# EAGLE design Main (EAGLE 9.6.2)
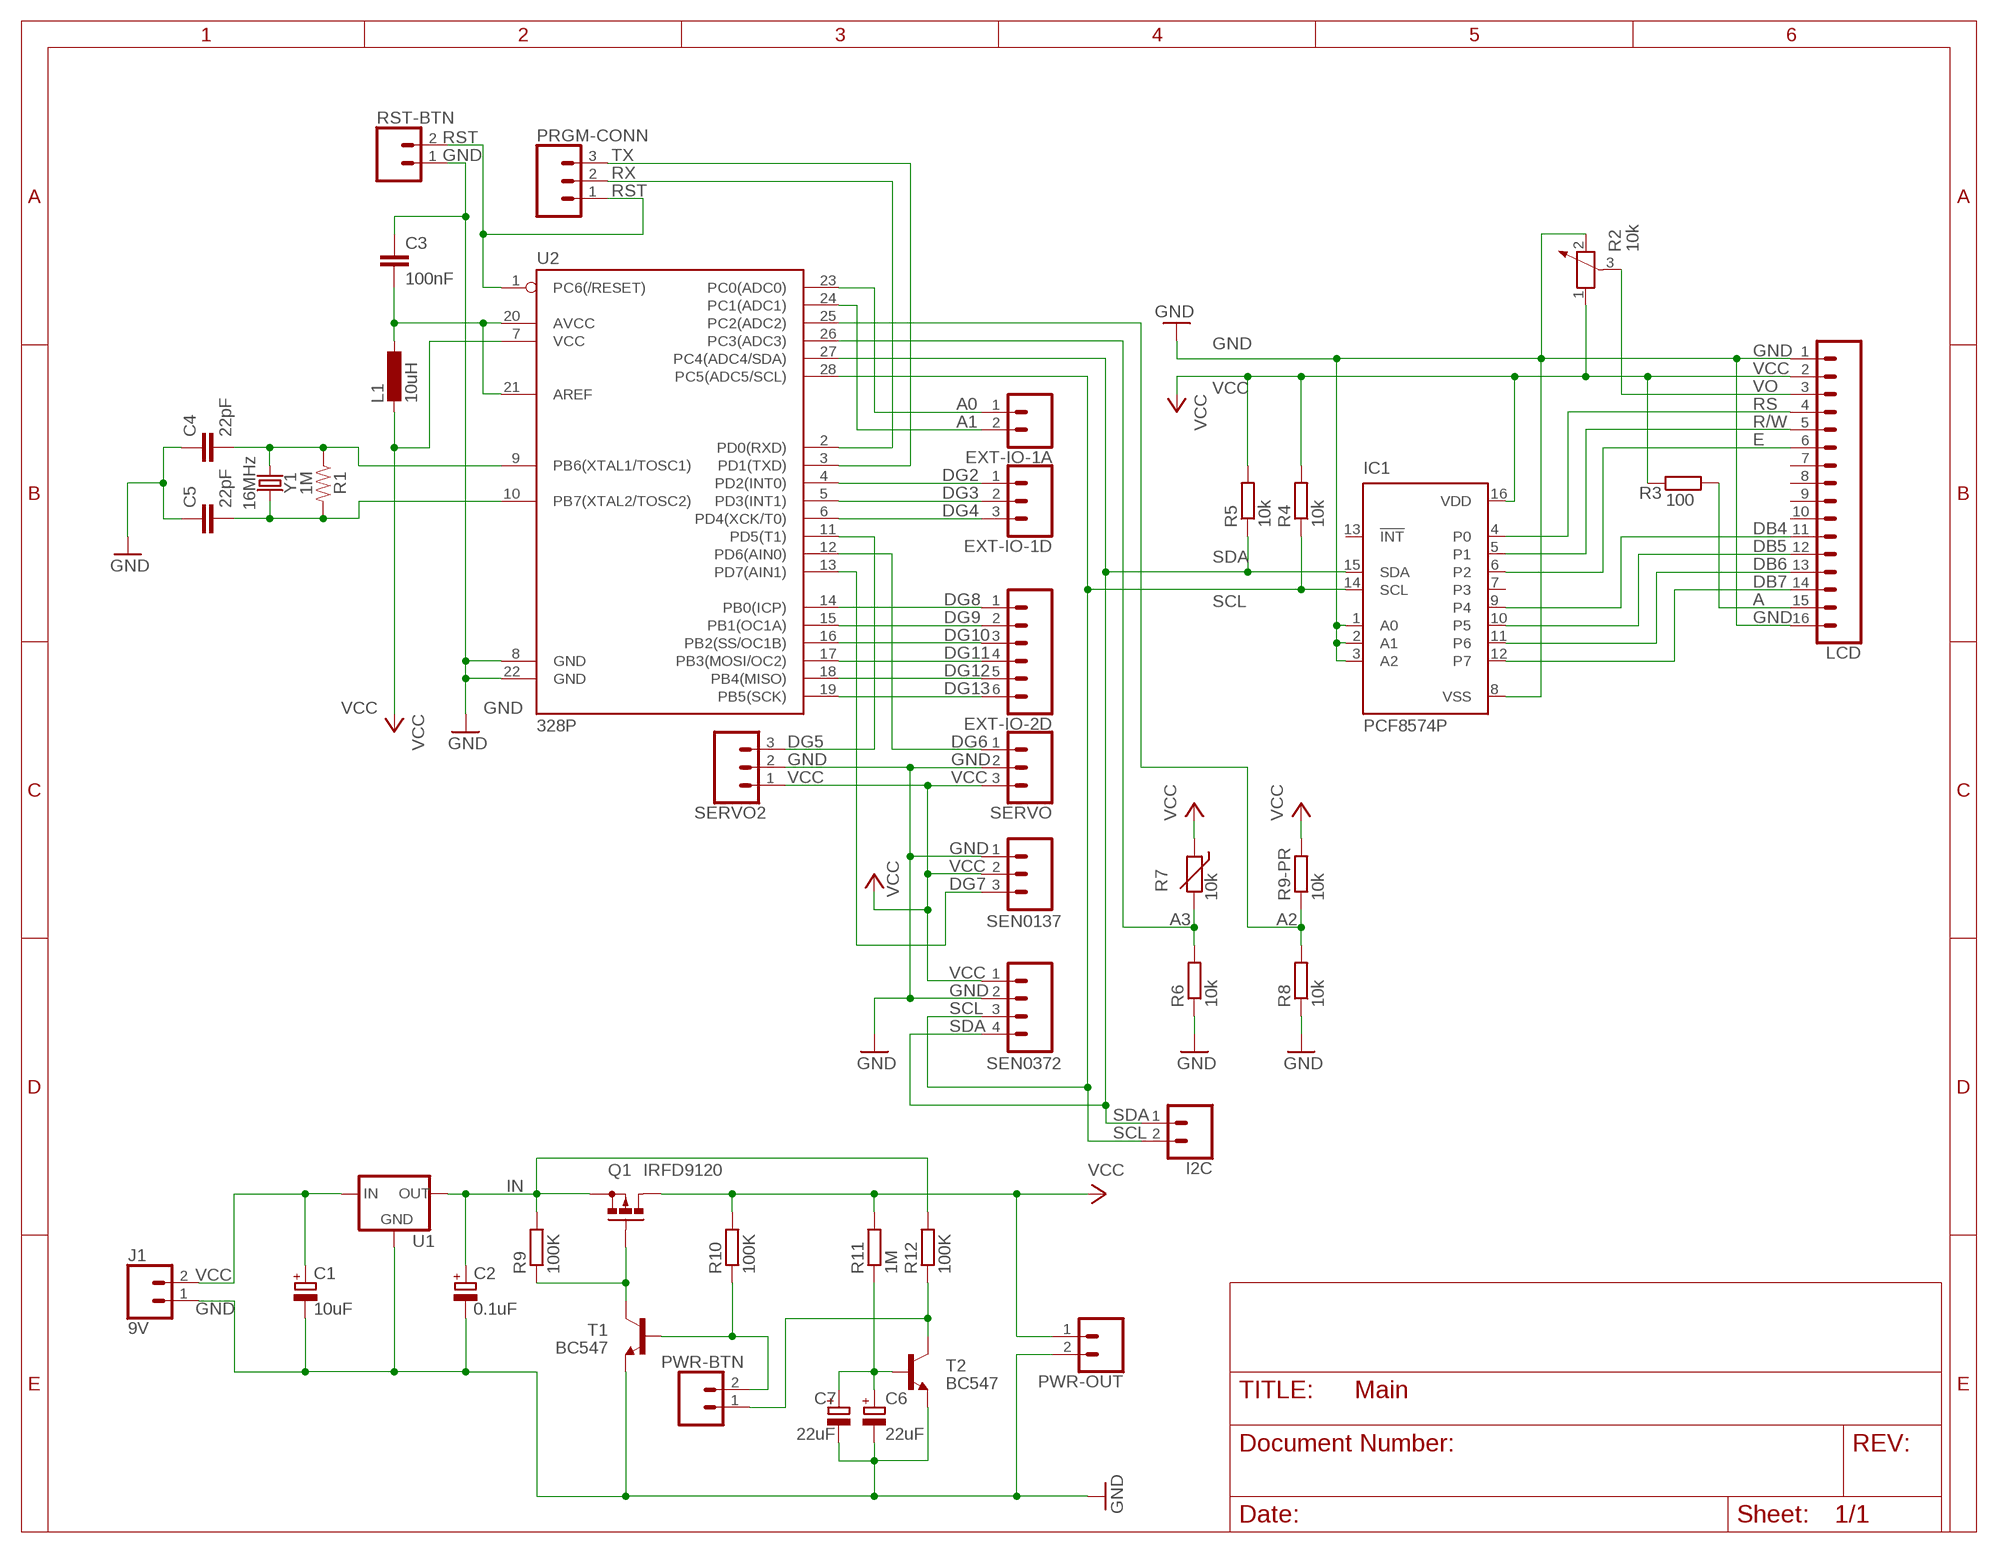
[diagram p0: schematic, sheet 1]

## Parts
C1  10uF  CPOL-EUE2.5-5  [E2,5-5]
C2  0.1uF  CPOL-EUE2-4  [E2-4]
C3  100nF  C-EU050-025X075  [C050-025X075]
C4  22pF  22PF-PTH-2.54MM-200V-5%  [CAP-PTH-2.54]
C5  22pF  22PF-PTH-2.54MM-200V-5%  [CAP-PTH-2.54]
C6  22uF  CPOL-EUE2-5  [E2-5]
C7  22uF  CPOL-EUE2-5  [E2-5]
EXT-IO-1A  CONN_02LOCK_LONGPADS  [1X02_LOCK_LONGPADS]
EXT-IO-1D  CONN_03LONGPADS  [1X03_LONGPADS]
EXT-IO-2D  CONN_06LONGPADS  [1X06_LONGPADS]
I2C  CONN_02LOCK_LONGPADS  [1X02_LOCK_LONGPADS]
IC1  PCF8574P  [DIL16]
J1  9V  CONN_02LOCK_LONGPADS  [1X02_LOCK_LONGPADS]
L1  10uH  L-EU0204/5  [0204/5]
LCD  CONN_16LONGPADS  [1X16_LONGPADS]
PRGM-CONN  CONN_03LONGPADS  [1X03_LONGPADS]
PWR-BTN  CONN_02LOCK_LONGPADS  [1X02_LOCK_LONGPADS]
PWR-OUT  CONN_02LOCK_LONGPADS  [1X02_LOCK_LONGPADS]
Q1  IRFD9120  [C370-01]
R1  1M  RESISTORAXIAL-0.3  [AXIAL-0.3]
R2  10k  POTENTIOMETER_PT-10  [PT-10]
R3  100  R-EU_0207/10  [0207/10]
R4  10k  R-EU_0207/10  [0207/10]
R5  10k  R-EU_0207/10  [0207/10]
R6  10k  R-EU_0207/10  [0207/10]
R7  10k  THERMISTOR-2,5  [RS-2,5]
R8  10k  R-EU_0207/10  [0207/10]
R9  100K  R-EU_0207/10  [0207/10]
R9-PR  10k  R-EU_0204/2V  [0204V]
R10  100K  R-EU_0207/10  [0207/10]
R11  1M  R-EU_0207/10  [0207/10]
R12  100K  R-EU_0207/10  [0207/10]
RST-BTN  CONN_02LOCK_LONGPADS  [1X02_LOCK_LONGPADS]
SEN0137  CONN_03LONGPADS  [1X03_LONGPADS]
SEN0372  CONN_04LONGPADS  [1X04_LONGPADS]
SERVO  CONN_03LONGPADS  [1X03_LONGPADS]
SERVO2  CONN_03LONGPADS  [1X03_LONGPADS]
T1  BC547  [TO92]
T2  BC547  [TO92]
U1  V_REG_78XX-TO-220  [TO-220-ALT]
U2  328P  ATMEGA328P_PDIP  [DIP28]
Y1  16MHz  CRYSTAL-16MHZPTH-HC49US  [HC49US]

## Nets
A: LCD.15 R3.2
A0: EXT-IO-1A.1 U2.23(PC0(ADC0))
A1: EXT-IO-1A.2 U2.24(PC1(ADC1))
A2: R8.2 R9-PR.1 U2.25(PC2(ADC2))
A3: R6.2 R7.2 U2.26(PC3(ADC3))
DB4: IC1.9(P4) LCD.11
DB5: IC1.10(P5) LCD.12
DB6: IC1.11(P6) LCD.13
DB7: IC1.12(P7) LCD.14
DG2: EXT-IO-1D.1 U2.4(PD2(INT0))
DG3: EXT-IO-1D.2 U2.5(PD3(INT1))
DG4: EXT-IO-1D.3 U2.6(PD4(XCK/T0))
DG5: SERVO2.3 U2.11(PD5(T1))
DG6: SERVO.1 U2.12(PD6(AIN0))
DG7: SEN0137.3 U2.13(PD7(AIN1))
DG8: EXT-IO-2D.1 U2.14(PB0(ICP))
DG9: EXT-IO-2D.2 U2.15(PB1(OC1A))
DG10: EXT-IO-2D.3 U2.16(PB2(SS/OC1B))
DG11: EXT-IO-2D.4 U2.17(PB3(MOSI/OC2))
DG12: EXT-IO-2D.5 U2.18(PB4(MISO))
DG13: EXT-IO-2D.6 U2.19(PB5(SCK))
E: IC1.6(P2) LCD.6
GND: C1.- C2.- C3.1 C4.1 C5.1 C6.- C7.- IC1.1(A0) IC1.2(A1) IC1.3(A2) IC1.8(VSS) J1.1 LCD.1 LCD.16 PWR-OUT.2 R2.2 R6.1 R8.1 RST-BTN.1 SEN0137.1 SEN0372.2 SERVO2.2 SERVO.2 T1.1(E) T2.1(E) U1.GND U2.8(GND) U2.22(GND)
IN: C2.+ Q1.S R9.2 R12.2 U1.OUT
N$1: Q1.G R9.1 T1.3(C)
N$2: C3.2 L1.1 U2.20(AVCC) U2.21(AREF)
N$3: C4.2 R1.P$1 U2.9(PB6(XTAL1/TOSC1)) Y1.1
N$4: C5.2 R1.P$2 U2.10(PB7(XTAL2/TOSC2)) Y1.2
N$9: PWR-BTN.2 R10.1 T1.2(B)
N$10: PWR-BTN.1 R12.1 T2.3(C)
N$11: C6.+ C7.+ R11.1 T2.2(B)
R/W: IC1.5(P1) LCD.5
RS: IC1.4(P0) LCD.4
RST: PRGM-CONN.1 RST-BTN.2 U2.1(PC6(/RESET))
RX: PRGM-CONN.2 U2.2(PD0(RXD))
SCL: I2C.2 IC1.14(SCL) R4.1 SEN0372.3 U2.28(PC5(ADC5/SCL))
SDA: I2C.1 IC1.15(SDA) R5.1 SEN0372.4 U2.27(PC4(ADC4/SDA))
TX: PRGM-CONN.3 U2.3(PD1(TXD))
VCC: C1.+ IC1.16(VDD) J1.2 L1.2 LCD.2 PWR-OUT.1 Q1.D Q1.D1(D) R2.1 R3.1 R4.2 R5.2 R7.1 R9-PR.2 R10.2 R11.2 SEN0137.2 SEN0372.1 SERVO2.1 SERVO.3 U1.IN U2.7(VCC)
VO: LCD.3 R2.3
Unconnected: IC1.7(P3) IC1.13(!INT) LCD.7 LCD.8 LCD.9 LCD.10

## Library data of the parts
C1 C2 C6 C7 = rcl:CPOL-EU: POLARIZED CAPACITOR, European symbol; SPICEPREFIX: C
C3 = rcl:C-EU: CAPACITOR, European symbol; SPICEPREFIX: C
C4 C5 = SparkFun-Capacitors:22PF: 22pF ceramic capacitors A capacitor is a passive two-terminal electrical component used to store electrical energy temporarily in an electric field.; PROD_ID: CAP-09128
EXT-IO-1A I2C J1 PWR-BTN PWR-OUT RST-BTN = SparkFun-Connectors:CONN_02: Multi connection point. Often used as Generic Header-pin footprint for 0.1 inch spaced/style header connections On any of the 0.1 inch spaced packages, you can populate with these: Break Away Headers - Straight <https://www.sparkfun.com/products/116> (PRT-00116) Break Away Male Headers - Right Angle <https://www.sparkfun.com/products/553> (PRT-00553) Female Headers <https://www.sparkfun.com/products/115> (PRT-00115) Break Away Headers - Machine Pin <https://www.sparkfun.com/products/117> (PRT-00117) Break Away Female Headers - Swiss Machine Pin <https://www.sparkfun.com/products/743> (PRT-00743) For SCREWTERMINALS and SPRING TERMINALS visit here: Screw Terimnals on SparkFun.com <https://www.sparkfun.com/search/results?term=Screw+Terminals> (5mm/3.5mm/2.54mm spacing) This device is also useful as a general connection point to wire up your design to another part of your project. Our various solder wires solder well into these plated through hole pads. Hook-Up Wire - Assortment (Stranded, 22 AWG) <https://www.sparkfun.com/products/11375> (PRT-11375) Hook-Up Wire - Assortment (Solid Core, 22 AWG) <https://www.sparkfun.com/products/11367> (PRT-11367) View the entire wire category on our website here <https://www.sparkfun.com/categories/141> Special notes: Molex polarized connector foot print use with: PRT-08233 with associated crimp pins and housings. 2.54_SCREWTERM for use with PRT-10571. 3.5mm Screw Terminal footprints for PRT-08084 5mm Screw Terminal footprints for use with PRT-08432
EXT-IO-1D PRGM-CONN SEN0137 SERVO SERVO2 = SparkFun-Connectors:CONN_03: Multi connection point. Often used as Generic Header-pin footprint for 0.1 inch spaced/style header connections On any of the 0.1 inch spaced packages, you can populate with these: Break Away Headers - Straight <https://www.sparkfun.com/products/116> (PRT-00116) Break Away Male Headers - Right Angle <https://www.sparkfun.com/products/553> (PRT-00553) Female Headers <https://www.sparkfun.com/products/115> (PRT-00115) Break Away Headers - Machine Pin <https://www.sparkfun.com/products/117> (PRT-00117) Break Away Female Headers - Swiss Machine Pin <https://www.sparkfun.com/products/743> (PRT-00743) Stackable Header - 3 Pin (Female, 0.1") <https://www.sparkfun.com/products/13875> (PRT-13875) For SCREWTERMINALS and SPRING TERMINALS visit here: Screw Terimnals on SparkFun.com <https://www.sparkfun.com/search/results?term=Screw+Terminals> (5mm/3.5mm/2.54mm spacing) This device is also useful as a general connection point to wire up your design to another part of your project. Our various solder wires solder well into these plated through hole pads. Hook-Up Wire - Assortment (Stranded, 22 AWG) <https://www.sparkfun.com/products/11375> (PRT-11375) Hook-Up Wire - Assortment (Solid Core, 22 AWG) <https://www.sparkfun.com/products/11367> (PRT-11367) View the entire wire category on our website here <https://www.sparkfun.com/categories/141> Special notes: Molex polarized connector foot print use with SKU : PRT-08232 with associated crimp pins and housings.
EXT-IO-2D = SparkFun-Connectors:CONN_06: Multi connection point. Often used as Generic Header-pin footprint for 0.1 inch spaced/style header connections On any of the 0.1 inch spaced packages, you can populate with these: Break Away Headers - Straight <https://www.sparkfun.com/products/116> (PRT-00116) Break Away Male Headers - Right Angle <https://www.sparkfun.com/products/553> (PRT-00553) Female Headers <https://www.sparkfun.com/products/115> (PRT-00115) Break Away Headers - Machine Pin <https://www.sparkfun.com/products/117> (PRT-00117) Break Away Female Headers - Swiss Machine Pin <https://www.sparkfun.com/products/743> (PRT-00743) Arduino Stackable Header - 6 Pin <https://www.sparkfun.com/products/9280> (PRT-09280) For SCREWTERMINALS and SPRING TERMINALS visit here: Screw Terimnals on SparkFun.com <https://www.sparkfun.com/search/results?term=Screw+Terminals> (5mm/3.5mm/2.54mm spacing) This device is also useful as a general connection point to wire up your design to another part of your project. Our various solder wires solder well into these plated through hole pads. Hook-Up Wire - Assortment (Stranded, 22 AWG) <https://www.sparkfun.com/products/11375> (PRT-11375) Hook-Up Wire - Assortment (Solid Core, 22 AWG) <https://www.sparkfun.com/products/11367> (PRT-11367) View the entire wire category on our website here <https://www.sparkfun.com/categories/141>
IC1 = micro-philips:PCF8574: I2C-Bus Remote 8-bit I/O expander http://www.semiconductors.philips.com/acrobat_download/datasheets/PCF8574_4.pdf; MPN: PCF8574PN; OC_FARNELL: 204020; OC_NEWARK: 11N8515
L1 = rcl:L-EU: INDUCTOR, European symbol; SPICEPREFIX: L
LCD = SparkFun-Connectors:CONN_16: Multi connection point. Often used as Generic Header-pin footprint for 0.1 inch spaced/style header connections On any of the 0.1 inch spaced packages, you can populate with these: Break Away Headers - Straight <https://www.sparkfun.com/products/116> (PRT-00116) Break Away Male Headers - Right Angle <https://www.sparkfun.com/products/553> (PRT-00553) Female Headers <https://www.sparkfun.com/products/115> (PRT-00115) Break Away Headers - Machine Pin <https://www.sparkfun.com/products/117> (PRT-00117) Break Away Female Headers - Swiss Machine Pin <https://www.sparkfun.com/products/743> (PRT-00743) For SCREWTERMINALS and SPRING TERMINALS visit here: Screw Terimnals on SparkFun.com <https://www.sparkfun.com/search/results?term=Screw+Terminals> (5mm/3.5mm/2.54mm spacing) This device is also useful as a general connection point to wire up your design to another part of your project. Our various solder wires solder well into these plated through hole pads. Hook-Up Wire - Assortment (Stranded, 22 AWG) <https://www.sparkfun.com/products/11375> (PRT-11375) Hook-Up Wire - Assortment (Solid Core, 22 AWG) <https://www.sparkfun.com/products/11367> (PRT-11367) View the entire wire category on our website here <https://www.sparkfun.com/categories/141> Special notes: Molex polarized connector foot print use with SKU : PRT-08231 with associated crimp pins and housings. 1MM SMD Version SKU: PRT-10208 NOTES ON THE VARIANTS LOCK and LOCK_LONGPADS... This footprint was designed to help hold the alignment of a through-hole component (i.e. 6-pin header) while soldering it into place. You may notice that each hole has been shifted either up or down by 0.005 of an inch from it's more standard position (which is a perfectly straight line). This slight alteration caused the pins (the squares in the middle) to touch the edges of the holes. Because they are alternating, it causes a "brace" to hold the component in place. 0.005 has proven to be the perfect amount of "off-center" position when using our standard breakaway headers. Although looks a little odd when you look at the bare footprint, once you have a header in there, the alteration is very hard to notice. Also,if you push a header all the way into place, it is covered up entirely on the bottom side.
Q1 = transistor-small-signal:IRFD9120: P-CHANNEL MOS FET
R1 = SparkFun-Resistors:RESISTOR: Generic Resistor Package
R2 = rcl:POTENTIOMETER_: Potentiometer; SPICEMODEL: POT; SPICEPREFIX: X
R3-R6 R8 R9 R9-PR R10-R12 = rcl:R-EU_: RESISTOR, European symbol; SPICEPREFIX: R
R7 = varistor:THERMISTOR: THERMISTOR
SEN0372 = SparkFun-Connectors:CONN_04: Multi connection point. Often used as Generic Header-pin footprint for 0.1 inch spaced/style header connections On any of the 0.1 inch spaced packages, you can populate with these: Break Away Headers - Straight <https://www.sparkfun.com/products/116> (PRT-00116) Break Away Male Headers - Right Angle <https://www.sparkfun.com/products/553> (PRT-00553) Female Headers <https://www.sparkfun.com/products/115> (PRT-00115) Break Away Headers - Machine Pin <https://www.sparkfun.com/products/117> (PRT-00117) Break Away Female Headers - Swiss Machine Pin <https://www.sparkfun.com/products/743> (PRT-00743) For SCREWTERMINALS and SPRING TERMINALS visit here: Screw Terimnals on SparkFun.com <https://www.sparkfun.com/search/results?term=Screw+Terminals> (5mm/3.5mm/2.54mm spacing) This device is also useful as a general connection point to wire up your design to another part of your project. Our various solder wires solder well into these plated through hole pads. Hook-Up Wire - Assortment (Stranded, 22 AWG) <https://www.sparkfun.com/products/11375> (PRT-11375) Hook-Up Wire - Assortment (Solid Core, 22 AWG) <https://www.sparkfun.com/products/11367> (PRT-11367) View the entire wire category on our website here <https://www.sparkfun.com/categories/141> Special notes: Molex polarized connector foot print use with SKU : PRT-08231 with associated crimp pins and housings. 1MM SMD Version SKU: PRT-10208; PROD_ID: CONN-09696
T1 T2 = transistor:BC547: NPN TRANSISTOR
U1 = SparkFun-IC-Power:V_REG_78XX: Voltage Regulator Standard 78xx regulator. IGO (Input Ground Output). Spark Fun Electronics SKU : COM-00107; PROD_ID: VREG-08450; SF_ID: COM-00107
U2 = SparkFun-IC-Microcontroller:ATMEGA328P_PDIP: Atmel 328P Through hole ATMEGA328P uC used in the Arduino 32kb flash, 1k EEPROM, 2k SRAM Datasheet <http://www.sparkfun.com/datasheets/Components/SMD/ATMega328.pdf> SparkFun Products Storefront component: AVR 28 Pin 20MHz 32K 6A/D - ATMega328P <https://www.sparkfun.com/products/9061> (COM-09061) SparkFun Simon Says - Through-Hole Soldering Kit <https://www.sparkfun.com/products/10547> (KIT-10547) SparkFun Learn to Solder - Simon Says <https://www.sparkfun.com/products/13708> (KIT-13708) SparkFun BigTime Watch Kit <https://www.sparkfun.com/products/11734> (KIT-11734) SparkFun ClockIt <https://www.sparkfun.com/products/10930> (KIT-10930) SparkFun Serial Enabled LCD Kit <https://www.sparkfun.com/products/10097> (LCD-10097) SparkFun Simon Tilts - Through Hole Soldering Kit <https://www.sparkfun.com/products/12634> (KIT-12634) SparkFun Frequency Counter Kit <https://www.sparkfun.com/products/10140> (KIT-10140) FabFM Radio Kit <https://www.sparkfun.com/products/11043> (KIT-11043) SparkFun Binary Blaster Kit <https://www.sparkfun.com/products/12037> (KIT-12037) SparkFun Metro-Gnome <https://www.sparkfun.com/products/9236> (KIT-09236) ATmega328 with Arduino Optiboot (Uno) <https://www.sparkfun.com/products/10524> (DEV-10524); PROD_ID: IC-09136
Y1 = SparkFun-Clocks:CRYSTAL-16MHZ: 16MHz Crystal Digikey Example <http://www.digikey.com/product-search/en?keywords=535-9122-1-ND> Frequency: 16MHz Frequency Stability: ±50ppm Frequency Tolerance: ±20ppm Load Capacitance: 18pF SparkFun Products: Pro Micro -5V/16MHz <https://www.sparkfun.com/products/12640> SparkFun Serial Enabled LCD Kit <https://www.sparkfun.com/products/10097>; PROD_ID: XTAL-08181; SF_ID: COM-00536

## Board
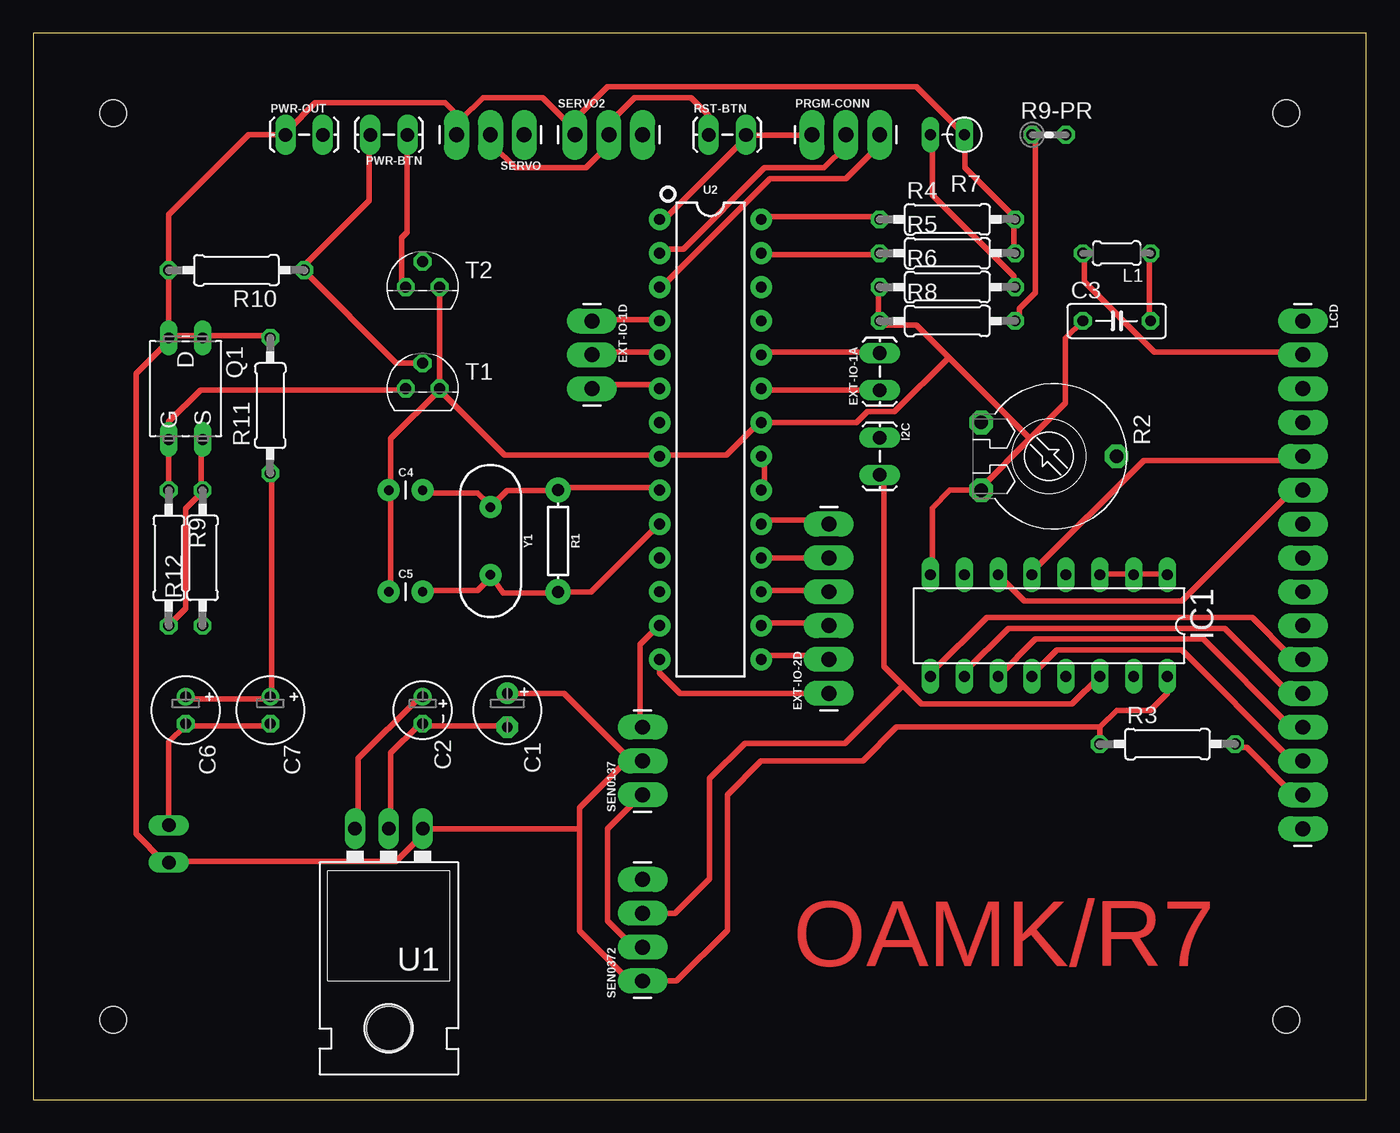
[diagram p1: board, top side]
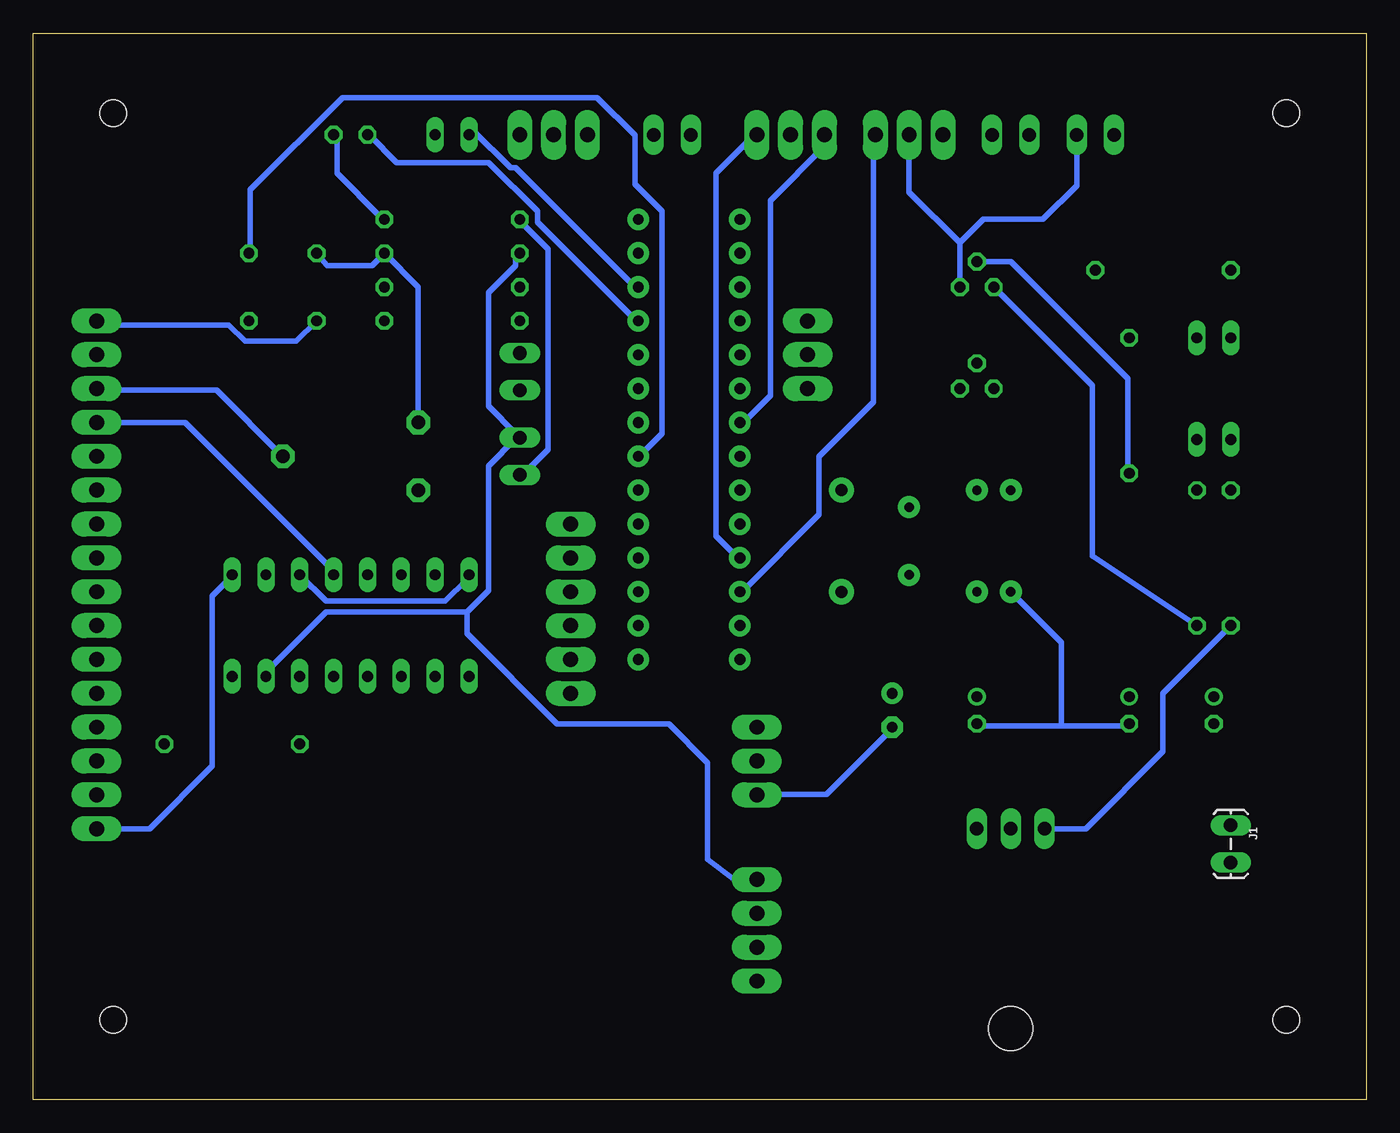
[diagram p2: board, bottom side, seen from below]

Size 100 x 80 mm. Coordinates in mm from the lower left corner, seen from the top.
Outline: 0,0 100,0 100,80 0,80 0,0
Copper layers (1*16): Top 0.018mm / dielectric 1mm / Bottom 0.018mm
Design rules "RULES *": minimum track width 16mil, minimum drill 0.3mm, track to track 16mil, track to pad 16mil, pad to pad 16mil, via to via 16mil, smd to smd 16mil, copper to edge 40mil, drill to drill 16mil, minimum pad ring 10mil, minimum via ring 8mil, stop-mask expansion 4mil, vias tented up to drill 0mil, thermal gap 10mil
Holes 2 mm at 6,6 94,6 6,74 94,74

### Footprints (pad centres in the part's own frame; a part is rotated, then mirrored left to right if it is on the bottom)
E2,5-5 = drill 0.813 pad 1.6: + -1.27,0 | drill 0.813 pad 1.6 octagon: - 1.27,0
E2-4 = drill 0.813 pad 1.27: + -1.016,0 | drill 0.813 pad 1.27 octagon: - 1.016,0
C050-025X075 = drill 0.813 octagon: 1 -2.54,0; 2 2.54,0
CAP-PTH-2.54 = drill 0.7 pad 1.651: 1 -1.27,0; 2 1.27,0
E2-5 = drill 0.813 pad 1.27: + -1.016,0 | drill 0.813 pad 1.27 octagon: - 1.016,0
1X02_LOCK_LONGPADS = drill 1.016 long: 1 -0.127,0; 2 2.667,0
1X03_LONGPADS = drill 1.118 pad 1.88 long: 1 0,0; 2 2.54,0; 3 5.08,0
1X06_LONGPADS = drill 1.118 pad 1.88 long: 1 0,0; 2 2.54,0; 3 5.08,0; 4 7.62,0; 5 10.16,0; 6 12.7,0
DIL16 = drill 0.813 long: 1 -8.89,-3.81; 2 -6.35,-3.81; 3 -3.81,-3.81; 4 -1.27,-3.81; 5 1.27,-3.81; 6 3.81,-3.81; 7 6.35,-3.81; 8 8.89,-3.81; 9 8.89,3.81; 10 6.35,3.81; 11 3.81,3.81; 12 1.27,3.81; 13 -1.27,3.81; 14 -3.81,3.81; 15 -6.35,3.81; 16 -8.89,3.81
0204/5 = drill 0.813 octagon: 1 -2.54,0; 2 2.54,0
1X16_LONGPADS = drill 1.118 pad 1.88 long: 1 0,0; 2 2.54,0; 3 5.08,0; 4 7.62,0; 5 10.16,0; 6 12.7,0; 7 15.24,0; 8 17.78,0; 9 20.32,0; 10 22.86,0; 11 25.4,0; 12 27.94,0; 13 30.48,0; 14 33.02,0; 15 35.56,0; 16 38.1,0
C370-01 = drill 0.813 long: D -3.81,1.27; D1 -3.81,-1.27; G 3.81,-1.27; S 3.81,1.27
AXIAL-0.3 = drill 0.9 pad 1.88: P$1 -3.81,0; P$2 3.81,0
PT-10 = drill 1.016 pad 1.778 octagon: 1 -2.54,-5.08; 2 2.54,-5.08; 3 0,5.08
0207/10 = drill 0.813 octagon: 1 -5.08,0; 2 5.08,0
RS-2,5 = drill 0.813 long: 1 -1.27,0; 2 1.27,0
0204V = drill 0.813 octagon: 1 -1.27,0; 2 1.27,0
1X04_LONGPADS = drill 1.118 pad 1.88 long: 1 0,0; 2 2.54,0; 3 5.08,0; 4 7.62,0
TO92 = drill 0.813 octagon: 1 1.27,0; 2 0,1.905; 3 -1.27,0
TO-220-ALT = drill 1.016 long: GND 0,-3.81; IN -2.54,-3.81; OUT 2.54,-3.81 | hole 3.302: 0,11.176
DIP28 = drill 0.813 pad 1.626: 1 -16.51,-3.81; 2 -13.97,-3.81; 3 -11.43,-3.81; 4 -8.89,-3.81; 5 -6.35,-3.81; 6 -3.81,-3.81; 7 -1.27,-3.81; 8 1.27,-3.81; 9 3.81,-3.81; 10 6.35,-3.81; 11 8.89,-3.81; 12 11.43,-3.81; 13 13.97,-3.81; 14 16.51,-3.81; 15 16.51,3.81; 16 13.97,3.81; 17 11.43,3.81; 18 8.89,3.81; 19 6.35,3.81; 20 3.81,3.81; 21 1.27,3.81; 22 -1.27,3.81; 23 -3.81,3.81; 24 -6.35,3.81; 25 -8.89,3.81; 26 -11.43,3.81; 27 -13.97,3.81; 28 -16.51,3.81
HC49US = drill 0.7 pad 1.651: 1 -2.54,0; 2 2.54,0

### Placement (x,y rotation side)
C1  35.56,29.21 270 top
C2  29.21,29.21 270 top
C3  81.28,58.42 0 top
C4  27.94,45.72 0 top
C5  27.94,38.1 0 top
C6  11.43,29.21 270 top
C7  17.78,29.21 270 top
EXT-IO-1A  63.5,53.34 90 top
EXT-IO-1D  41.91,58.42 270 top
EXT-IO-2D  59.69,30.48 90 top
I2C  63.5,49.53 270 top
IC1  76.2,35.56 180 top
J1  10.16,20.45 270 bottom
L1  81.28,63.5 180 top
LCD  95.25,58.42 270 top
PRGM-CONN  58.42,72.39 0 top
PWR-BTN  27.94,72.39 180 top
PWR-OUT  19.05,72.39 0 top
Q1  11.43,53.34 270 top
R1  39.37,41.91 270 top
R2  76.2,48.26 270 top
R3  85.09,26.67 0 top
R4  68.58,66.04 0 top
R5  68.58,63.5 0 top
R6  68.58,60.96 0 top
R7  68.58,72.39 180 top
R8  68.58,58.42 0 top
R9  10.16,40.64 270 top
R9-PR  76.2,72.39 0 top
R10  15.24,62.23 180 top
R11  17.78,52.07 90 top
R12  12.7,40.64 90 top
RST-BTN  50.8,72.39 0 top
SEN0137  45.72,22.86 90 top
SEN0372  45.72,8.89 90 top
SERVO  36.83,72.39 180 top
SERVO2  40.64,72.39 0 top
T1  29.21,53.34 0 top
T2  29.21,60.96 0 top
U1  26.67,16.51 180 top
U2  50.8,49.53 270 top
Y1  34.29,41.91 270 top

### Tracks (layer width: path | path; a pad name or v marks a point on that pad's centre or on a via)
A
  Top 0.406: R3.2 90.22,26.42 91.03,26.42 94.28,23.16 95.1,23.16 LCD.15
A0
  Top 0.406: EXT-IO-1A.1 63.4,53.24 54.86,53.24 U2.23
A1
  Top 0.406: EXT-IO-1A.2 63.4,56.08 54.86,56.08 U2.24
A2
  Top 0.406: R8.2 73.97,58.52 73.97,59.33 75.18,60.55 75.18,72.34 R9-PR.1
  Bottom 0.406: U2.25 54.86,58.52 62.18,65.84 62.18,66.65 65.84,70.31 72.75,70.31 74.78,72.34 R9-PR.1
A3
  Top 0.406: R6.2 73.56,60.96 73.56,61.77 67.46,67.87 67.46,72.34 R7.2
  Bottom 0.406: U2.26 54.86,60.96 63.8,69.9 64.21,69.9 67.06,72.75 R7.2
DB4
  Top 0.406: IC1.9 67.46,32.11 71.53,36.17 91.44,36.17 94.28,33.33 95.1,33.33 LCD.11
DB5
  Top 0.406: LCD.12 94.28,30.48 89.41,35.36 73.15,35.36 69.9,32.11 IC1.10
DB6
  Top 0.406: IC1.11 75.18,34.54 87.78,34.54 94.28,28.04 95.1,28.04 LCD.13
DB7
  Top 0.406: IC1.12 75.18,32.11 76.81,33.73 86.16,33.73 94.28,25.6 95.1,25.6 LCD.14
DG2
  Top 0.406: U2.4 46.74,58.52 42.27,58.52 EXT-IO-1D.1
DG3
  Top 0.406: U2.5 46.74,56.08 42.27,56.08 EXT-IO-1D.2
DG4
  Top 0.406: U2.6 46.74,53.65 42.27,53.65 EXT-IO-1D.3
DG5
  Bottom 0.406: U2.11 47.14,40.64 48.77,42.27 48.77,69.49 45.92,72.34 SERVO2.3
DG6
  Bottom 0.406: U2.12 46.74,38.2 41.05,43.89 41.05,48.26 36.98,52.32 36.98,72.34 SERVO.1
DG7
  Top 0.406: U2.13 46.74,35.36 45.52,34.14 45.52,28.04 SEN0137.3
DG8
  Top 0.406: U2.14 46.99,32 48.51,30.48 EXT-IO-2D.1
DG9
  Top 0.406: U2.15 54.86,33.33 59.33,33.33 EXT-IO-2D.2
DG10
  Top 0.406: U2.16 54.86,35.76 59.33,35.76 EXT-IO-2D.3
DG11
  Top 0.406: U2.17 54.86,38.2 59.33,38.2 EXT-IO-2D.4
DG12
  Top 0.406: EXT-IO-2D.5 U2.18
DG13
  Top 0.406: U2.19 54.86,43.48 59.33,43.48 EXT-IO-2D.6
E
  Top 0.406: IC1.6 74.37,37.39 86.16,37.39 94.28,45.52 95.1,45.52 LCD.6
GND
  Top 0.406: IC1.3 80.06,39.42 82.5,39.42 IC1.2 82.91,39.42 84.94,39.42 IC1.1 | R6.1 63.4,60.96 63.4,58.52 R8.1 63.8,58.12 66.24,58.12 68.68,55.68 | IC1.8 67.46,39.42 67.46,44.4 68.78,45.72 R2.2 71.12,45.92 74.78,49.58 | 74.78,49.58 77.44,52.24 77.44,57.12 C3.1 | 74.78,49.58 68.68,55.68 | 68.68,55.68 64.62,51.61 62.59,51.61 61.77,50.8 U2.22 54.46,50.8 52.02,48.36 47.14,48.36 U2.8 46.74,48.36 35.36,48.36 30.48,53.24 | C7.- 17.48,28.04 11.79,28.04 C6.- 11.38,28.04 10.16,26.82 J1.1 | SEN0372.2 45.52,11.79 44.7,11.79 43.08,13.41 43.08,20.32 45.52,22.76 SEN0137.1 | C1.- 35.36,28.04 29.26,28.04 C2.- 28.85,28.04 26.82,26.01 26.82,20.32 U1.GND | RST-BTN.1 50.67,73.84 49.33,75.18 45.11,75.18 43.48,73.56 43.48,72.75 SERVO2.2 43.08,72.34 43.08,71.53 41.45,69.9 36.17,69.9 34.54,71.53 34.54,72.34 SERVO.2 | C5.1 26.82,38.2 26.82,45.52 C4.1 26.82,45.92 26.82,49.58 30.48,53.24 | T2.1 T1.1 30.48,53.24
  Bottom 0.406: LCD.16 91.28,20.32 86.56,25.04 86.56,37.8 85.34,39.01 IC1.1 | LCD.1 95.1,58.12 85.34,58.12 84.12,56.9 80.26,56.9 C3.1 | IC1.3 78.03,37.39 69.09,37.39 67.46,39.01 IC1.8 | SEN0137.1 45.69,22.89 40.5,22.89 35.76,27.64 C1.- | 22.86,28.04 28.85,28.04 C2.- | T2.1 30.48,64.29 | C5.1 22.86,34.29 22.86,28.04 | 30.48,64.29 34.29,68.1 SERVO.2 | 30.48,64.29 28.73,66.04 24.26,66.04 21.72,68.58 PWR-OUT.2 | C7.- 17.93,28.04 22.86,28.04
IN
  Top 0.406: C2.+ 28.85,30.07 24.38,25.6 24.38,20.32 U1.OUT | R9.2 11.43,36.83 11.43,44.35 12.6,45.52 R12.2 12.6,45.92 12.6,49.17 Q1.S
  Bottom 0.406: R9.2 15.24,30.48 15.24,26.11 21.03,20.32 U1.OUT
N$1
  Top 0.406: R9.1 Q1.G 10.16,50.85 12.55,53.24 27.64,53.24 T1.3
N$2
  Top 0.406: C3.2 83.72,58.52 83.72,63.45 L1.1 | U2.20 54.86,45.92 54.86,47.95 U2.21
  Bottom 0.406: L1.1 83.72,63.86 83.72,68.28 76.81,75.18 57.71,75.18 54.86,72.34 54.86,68.68 52.83,66.65 52.83,49.99 54.46,48.36 U2.21
N$3
  Top 0.406: U2.9 46.74,45.92 39.42,45.92 R1.P$1 39.34,45.7 35.54,45.7 Y1.1 34.14,44.7 33.33,45.52 29.26,45.52 C4.2
N$4
  Top 0.406: C5.2 29.26,38.2 33.33,38.2 34.14,39.01 Y1.2 35.26,38.01 39.28,38.01 R1.P$2 41.86,38.1 46.91,43.15 U2.10
N$9
  Top 0.406: T1.2 28.85,55.27 27.23,55.27 20.32,62.18 R10.1 20.32,62.59 25.2,67.46 25.2,72.34 PWR-BTN.2
N$10
  Top 0.406: PWR-BTN.1 28.04,72.34 28.04,65.08 27.64,64.67 27.64,60.96 T2.3
  Bottom 0.406: R12.1 20.55,40.79 20.55,53.56 T2.3
N$11
  Top 0.406: C6.+ 11.79,30.07 17.48,30.07 C7.+ 17.88,30.48 17.88,46.74 R11.1
  Bottom 0.406: T2.2 26.64,62.87 17.88,54.1 17.88,47.14 R11.1
R/W
  Top 0.406: IC1.5 74.93,39.57 83.31,47.95 95.1,47.95 LCD.5
RS
  Bottom 0.406: IC1.4 77.47,39.67 88.59,50.8 LCD.4
RST
  Top 0.406: 53.65,72.34 58.12,72.34 PRGM-CONN.1 | 53.65,72.34 47.35,66.04 U2.1 | 53.65,72.34 RST-BTN.2
RX
  Top 0.406: PRGM-CONN.2 60.96,71.53 59.33,69.9 54.86,69.9 48.77,63.8 47.14,63.8 U2.2
SCL
  Top 0.406: R4.1 63.4,66.24 54.86,66.24 U2.28 | 65.25,31.06 63.8,32.51 63.8,46.74 I2C.2 | 65.25,31.06 66.65,29.67 77.93,29.67 IC1.14 | 65.25,31.06 60.91,26.72 53.39,26.72 50.75,24.08 50.75,16.56 48.16,13.97 SEN0372.3
  Bottom 0.406: R4.1 63.4,65.84 61.37,63.8 61.37,48.77 63.4,46.74 I2C.2
SDA
  Top 0.406: R5.1 63.4,63.4 54.86,63.4 U2.27
  Bottom 0.406: 67.46,36.58 78.03,36.58 82.5,32.11 IC1.15 | 67.46,36.58 65.84,38.2 65.84,47.55 63.8,49.58 I2C.1 63.8,49.99 65.84,52.02 65.84,60.55 63.8,62.59 63.8,63.4 R5.1 | 67.46,36.58 67.46,34.95 60.71,28.19 52.32,28.19 49.4,25.27 49.4,18 47.41,16.51 SEN0372.4
TX
  Top 0.406: U2.3 47.14,60.96 55.27,69.09 60.96,69.09 63.4,71.53 63.4,72.34 PRGM-CONN.3
VCC
  Top 0.406: 10.16,17.88 27.23,17.88 28.85,19.51 28.85,20.32 U1.IN 41,20.32 | 10.16,17.88 9.75,17.88 7.72,19.91 7.72,54.46 10.16,56.9 Q1.D1 10.16,57.3 | C1.+ 39.83,30.48 44.7,25.6 | 44.7,25.6 45.52,25.6 SEN0137.2 | 41,20.32 41,21.89 44.7,25.6 | R5.2 73.56,63.8 73.56,65.84 R4.2 73.56,66.24 69.9,69.9 69.9,72.34 R7.1 66.24,76 43.08,76 40.23,73.15 | LCD.2 95.1,56.08 84.12,56.08 78.84,61.37 78.84,63.45 L1.2 | 10.16,57.3 12.6,57.3 Q1.D 13.01,57.3 17.48,57.3 R11.2 | 10.16,57.3 R10.2 10.16,66.4 16.15,72.39 PWR-OUT.1 19.1,72.75 21.13,74.78 30.89,74.78 32.11,73.56 | 32.11,73.56 32.11,72.75 SERVO.3 32.11,73.56 | 32.11,73.56 33.73,75.18 38.2,75.18 40.23,73.15 | 40.23,73.15 40.64,72.75 SERVO2.1 40.23,73.15 | 10.16,17.88 J1.2 | IC1.16 85.09,30.48 83.82,29.21 81.28,29.21 80.01,27.94 | R3.1 80.01,27.94 | 80.01,27.94 64.77,27.94 62.23,25.4 54.61,25.4 52.07,22.86 52.07,16 52.07,12.7 48.26,8.89 45.97,8.89 45.92,8.94 SEN0372.1 45.52,8.94 44.7,8.94 41,12.65 41,20.32
  Bottom 0.406: L1.2 77.96,62.59 74.57,62.59 R5.2 71.12,60.96 R2.1 | R9-PR.2 77.22,72.34 77.22,69.49 73.97,66.24 R4.2 | SERVO2.1 40.64,71.53 44.7,67.46 44.7,52.83 46.74,50.8 U2.7
VO
  Bottom 0.406: LCD.3 95.1,53.24 86.26,53.24 R2.3

### Text on the board
Top: OAMK/R7